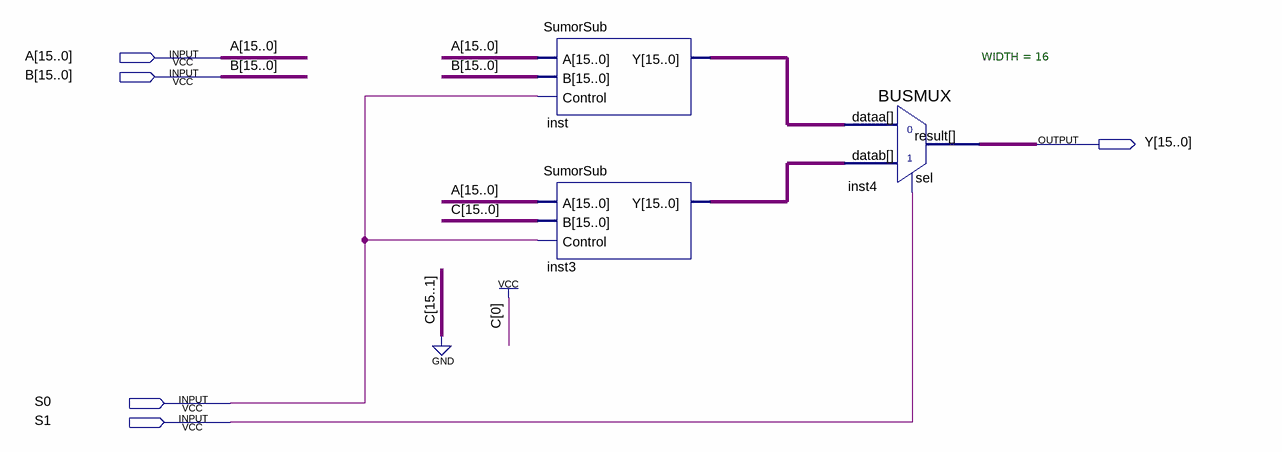
[diagram p0: schematic sheet]
// Quartus schematic AU.bdf as structural Verilog: 3 symbols, 5 pins
module AU (
  input  [15:0] A,
  input  [15:0] B,
  input  S0,
  input  S1,
  output [15:0] Y
);

  wire [15:0] inst3_y, inst_y;

  SumorSub inst (.A(A), .B(B), .Control(S0), .Y(inst_y));
  SumorSub inst3 (.A(A), .B(16'b0000000000000001), .Control(S0), .Y(inst3_y));
  BUSMUX #(.WIDTH(16)) inst4 (.datab(inst3_y), .sel(S1), .dataa(inst_y), .result(Y));
endmodule
